# Altium schematic sheet segment1.SchDoc
size A3; SPICEModelCacheRLVYLVLF: <root> / <DocumentId>RLVYLVLF</DocumentId> / <CacheFrame Number="0"> / <Model Name="dtunnel1" Kind="CKT"> / <Text>*Tunnel Diode Default / *MCE 600V 50A 27.2ns default parameters / *Diode Pinout: A,K / * Parameters: / * RS:  Series resistance value / * RP:  Negative resistance value in parallel with capacitance. / * CP:   Capacitance value in parallel with negative resistance. / * LS:  Series inductance value. / * / * / .SUBCKT DTUNNEL1 1 2 PARAMS: Rs=6 Rp=-75 Cp=0.6E-12 Ls=0.1nH / RS  1 3  {Rs} / RP  3 4  {Rp} / CP  3 4  {Cp} / LS  4 2  {Ls} / .ENDS DTUNNEL1</Text> / </Model> / </CacheFrame> / </root>
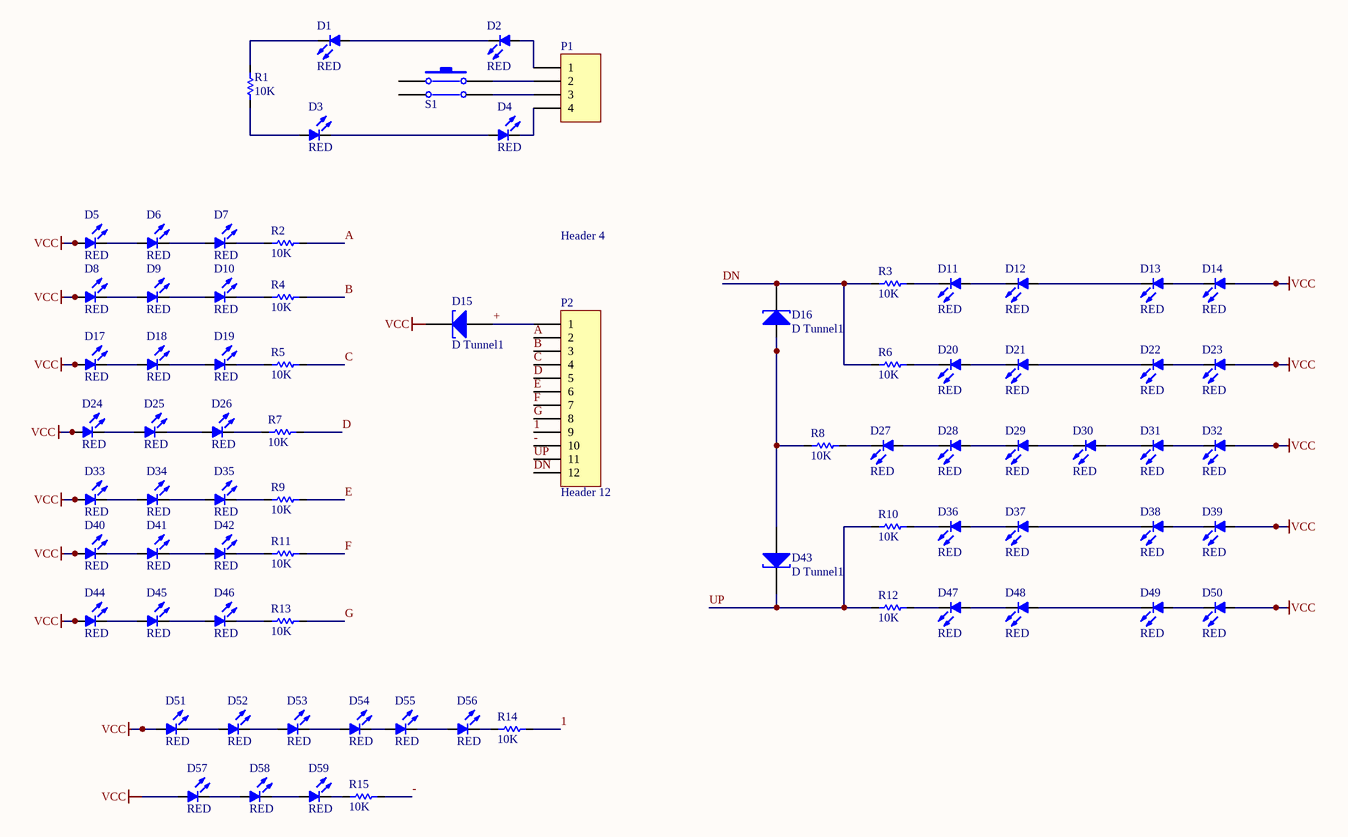
[diagram p0: segment1.SchDoc]

## Parts
D1  COLOR: RED  [RES 0805 (2012X06L)]  (hidden comment: MODEL)
D2  COLOR: RED  [RES 0805 (2012X06L)]  (hidden comment: MODEL)
D3  COLOR: RED  [RES 0805 (2012X06L)]  (hidden comment: MODEL)
D4  COLOR: RED  [RES 0805 (2012X06L)]  (hidden comment: MODEL)
D5  COLOR: RED  [RES 0805 (2012X06L)]  (hidden comment: MODEL)
D6  COLOR: RED  [RES 0805 (2012X06L)]  (hidden comment: MODEL)
D7  COLOR: RED  [RES 0805 (2012X06L)]  (hidden comment: MODEL)
D8  COLOR: RED  [RES 0805 (2012X06L)]  (hidden comment: MODEL)
D9  COLOR: RED  [RES 0805 (2012X06L)]  (hidden comment: MODEL)
D10  COLOR: RED  [RES 0805 (2012X06L)]  (hidden comment: MODEL)
D11  COLOR: RED  [RES 0805 (2012X06L)]  (hidden comment: MODEL)
D12  COLOR: RED  [RES 0805 (2012X06L)]  (hidden comment: MODEL)
D13  COLOR: RED  [RES 0805 (2012X06L)]  (hidden comment: MODEL)
D14  COLOR: RED  [RES 0805 (2012X06L)]  (hidden comment: MODEL)
D15  D Tunnel1  [3.2X1.6X1.1]
D16  D Tunnel1  [3.2X1.6X1.1]
D17  COLOR: RED  [RES 0805 (2012X06L)]  (hidden comment: MODEL)
D18  COLOR: RED  [RES 0805 (2012X06L)]  (hidden comment: MODEL)
D19  COLOR: RED  [RES 0805 (2012X06L)]  (hidden comment: MODEL)
D20  COLOR: RED  [RES 0805 (2012X06L)]  (hidden comment: MODEL)
D21  COLOR: RED  [RES 0805 (2012X06L)]  (hidden comment: MODEL)
D22  COLOR: RED  [RES 0805 (2012X06L)]  (hidden comment: MODEL)
D23  COLOR: RED  [RES 0805 (2012X06L)]  (hidden comment: MODEL)
D24  COLOR: RED  [RES 0805 (2012X06L)]  (hidden comment: MODEL)
D25  COLOR: RED  [RES 0805 (2012X06L)]  (hidden comment: MODEL)
D26  COLOR: RED  [RES 0805 (2012X06L)]  (hidden comment: MODEL)
D27  COLOR: RED  [RES 0805 (2012X06L)]  (hidden comment: MODEL)
D28  COLOR: RED  [RES 0805 (2012X06L)]  (hidden comment: MODEL)
D29  COLOR: RED  [RES 0805 (2012X06L)]  (hidden comment: MODEL)
D30  COLOR: RED  [RES 0805 (2012X06L)]  (hidden comment: MODEL)
D31  COLOR: RED  [RES 0805 (2012X06L)]  (hidden comment: MODEL)
D32  COLOR: RED  [RES 0805 (2012X06L)]  (hidden comment: MODEL)
D33  COLOR: RED  [RES 0805 (2012X06L)]  (hidden comment: MODEL)
D34  COLOR: RED  [RES 0805 (2012X06L)]  (hidden comment: MODEL)
D35  COLOR: RED  [RES 0805 (2012X06L)]  (hidden comment: MODEL)
D36  COLOR: RED  [RES 0805 (2012X06L)]  (hidden comment: MODEL)
D37  COLOR: RED  [RES 0805 (2012X06L)]  (hidden comment: MODEL)
D38  COLOR: RED  [RES 0805 (2012X06L)]  (hidden comment: MODEL)
D39  COLOR: RED  [RES 0805 (2012X06L)]  (hidden comment: MODEL)
D40  COLOR: RED  [RES 0805 (2012X06L)]  (hidden comment: MODEL)
D41  COLOR: RED  [RES 0805 (2012X06L)]  (hidden comment: MODEL)
D42  COLOR: RED  [RES 0805 (2012X06L)]  (hidden comment: MODEL)
D43  D Tunnel1  [3.2X1.6X1.1]
D44  COLOR: RED  [RES 0805 (2012X06L)]  (hidden comment: MODEL)
D45  COLOR: RED  [RES 0805 (2012X06L)]  (hidden comment: MODEL)
D46  COLOR: RED  [RES 0805 (2012X06L)]  (hidden comment: MODEL)
D47  COLOR: RED  [RES 0805 (2012X06L)]  (hidden comment: MODEL)
D48  COLOR: RED  [RES 0805 (2012X06L)]  (hidden comment: MODEL)
D49  COLOR: RED  [RES 0805 (2012X06L)]  (hidden comment: MODEL)
D50  COLOR: RED  [RES 0805 (2012X06L)]  (hidden comment: MODEL)
D51  COLOR: RED  [RES 0805 (2012X06L)]  (hidden comment: MODEL)
D52  COLOR: RED  [RES 0805 (2012X06L)]  (hidden comment: MODEL)
D53  COLOR: RED  [RES 0805 (2012X06L)]  (hidden comment: MODEL)
D54  COLOR: RED  [RES 0805 (2012X06L)]  (hidden comment: MODEL)
D55  COLOR: RED  [RES 0805 (2012X06L)]  (hidden comment: MODEL)
D56  COLOR: RED  [RES 0805 (2012X06L)]  (hidden comment: MODEL)
D57  COLOR: RED  [RES 0805 (2012X06L)]  (hidden comment: MODEL)
D58  COLOR: RED  [RES 0805 (2012X06L)]  (hidden comment: MODEL)
D59  COLOR: RED  [RES 0805 (2012X06L)]  (hidden comment: MODEL)
P1  Header 4  [HDR1X4]
P2  Header 12  [HDR1X12]
R1  10K  [RES 1206 (3216X08L)]
R2  10K  [RES 1206 (3216X08L)]
R3  10K  [RES 1206 (3216X08L)]
R4  10K  [RES 1206 (3216X08L)]
R5  10K  [RES 1206 (3216X08L)]
R6  10K  [RES 1206 (3216X08L)]
R7  10K  [RES 1206 (3216X08L)]
R8  10K  [RES 1206 (3216X08L)]
R9  10K  [RES 1206 (3216X08L)]
R10  10K  [RES 1206 (3216X08L)]
R11  10K  [RES 1206 (3216X08L)]
R12  10K  [RES 1206 (3216X08L)]
R13  10K  [RES 1206 (3216X08L)]
R14  10K  [RES 1206 (3216X08L)]
R15  10K  [RES 1206 (3216X08L)]
S1  PUSH BUTTON DOUBLE  [PUSH BUTTON]  (value not drawn)

## Nets
VCC: D5.1(A) D8.1(A) D14.1(A) D15.2(K) D17.1(A) D23.1(A) D24.1(A) D32.1(A) D33.1(A) D39.1(A) D40.1(A) D44.1(A) D50.1(A) D51.1(A) D57.1(A)
1: P2.9 R14.1
+: D15.1(A) P2.1
-: P2.10 R15.1
A: P2.2 R2.1
B: P2.3 R4.1
C: P2.4 R5.1
D: P2.5 R7.1
DN: D16.2(K) P2.12 R3.1 R6.1
E: P2.6 R9.1
F: P2.7 R11.1
G: P2.8 R13.1
UP: D43.2(K) P2.11 R10.1 R12.1
NetD1_1: D1.1(A) D2.2(K)
NetD1_2: D1.2(K) R1.2
NetD2_1: D2.1(A) P1.1
NetD3_1: D3.1(A) R1.1
NetD3_2: D3.2(K) D4.1(A)
NetD4_2: D4.2(K) P1.4
NetD5_2: D5.2(K) D6.1(A)
NetD6_2: D6.2(K) D7.1(A)
NetD7_2: D7.2(K) R2.2
NetD8_2: D8.2(K) D9.1(A)
NetD9_2: D9.2(K) D10.1(A)
NetD10_2: D10.2(K) R4.2
NetD11_1: D11.1(A) D12.2(K)
NetD11_2: D11.2(K) R3.2
NetD12_1: D12.1(A) D13.2(K)
NetD13_1: D13.1(A) D14.2(K)
NetD16_1: D16.1(A) D43.1(A) R8.1
NetD17_2: D17.2(K) D18.1(A)
NetD18_2: D18.2(K) D19.1(A)
NetD19_2: D19.2(K) R5.2
NetD20_1: D20.1(A) D21.2(K)
NetD20_2: D20.2(K) R6.2
NetD21_1: D21.1(A) D22.2(K)
NetD22_1: D22.1(A) D23.2(K)
NetD24_2: D24.2(K) D25.1(A)
NetD25_2: D25.2(K) D26.1(A)
NetD26_2: D26.2(K) R7.2
NetD27_1: D27.1(A) D28.2(K)
NetD27_2: D27.2(K) R8.2
NetD28_1: D28.1(A) D29.2(K)
NetD29_1: D29.1(A) D30.2(K)
NetD30_1: D30.1(A) D31.2(K)
NetD31_1: D31.1(A) D32.2(K)
NetD33_2: D33.2(K) D34.1(A)
NetD34_2: D34.2(K) D35.1(A)
NetD35_2: D35.2(K) R9.2
NetD36_1: D36.1(A) D37.2(K)
NetD36_2: D36.2(K) R10.2
NetD37_1: D37.1(A) D38.2(K)
NetD38_1: D38.1(A) D39.2(K)
NetD40_2: D40.2(K) D41.1(A)
NetD41_2: D41.2(K) D42.1(A)
NetD42_2: D42.2(K) R11.2
NetD44_2: D44.2(K) D45.1(A)
NetD45_2: D45.2(K) D46.1(A)
NetD46_2: D46.2(K) R13.2
NetD47_1: D47.1(A) D48.2(K)
NetD47_2: D47.2(K) R12.2
NetD48_1: D48.1(A) D49.2(K)
NetD49_1: D49.1(A) D50.2(K)
NetD51_2: D51.2(K) D52.1(A)
NetD52_2: D52.2(K) D53.1(A)
NetD53_2: D53.2(K) D54.1(A)
NetD54_2: D54.2(K) D55.1(A)
NetD55_2: D55.2(K) D56.1(A)
NetD56_2: D56.2(K) R14.2
NetD57_2: D57.2(K) D58.1(A)
NetD58_2: D58.2(K) D59.1(A)
NetD59_2: D59.2(K) R15.2
NetP1_2: P1.2 S1.2
NetP1_3: P1.3 S1.4

Not connected (* = marked no-connect by the designer): S1 1 3

## Library data of the parts
D1-D14 D17-D42 D44-D59 = LED 5mm: Typical LED
D15 D16 D43 = D Tunnel1: Tunnel Diode - RLC Model; Published: 8-Jun-2000; LatestRevisionDate: 17-Jul-2002; LatestRevisionNote: Re-released for DXP Platform.; PackageVersion: Feb-2002; PackageReference: 3.2X1.6X1.1; Publisher: Altium Limited; PackageDescription: SM LED; 2 Flat Leads
P1 = Header 4: Header, 4-Pin; LatestRevisionDate: 17-Jul-2002; LatestRevisionNote: Re-released for DXP Platform.; Publisher: Altium Limited
P2 = Header 12: Header, 12-Pin; LatestRevisionDate: 17-Jul-2002; LatestRevisionNote: Re-released for DXP Platform.; Publisher: Altium Limited
R1-R15 = Resistor: Tolerance: 5%; Power: 1/4 W; Value: 10K
S1 = PUSH BUTTON DOUBLE: Switch